# EAGLE board UFBmod_2V1 (EAGLE 7.7.0), part 1 of 2
UFBmod - the best digital modulation ever created :-)
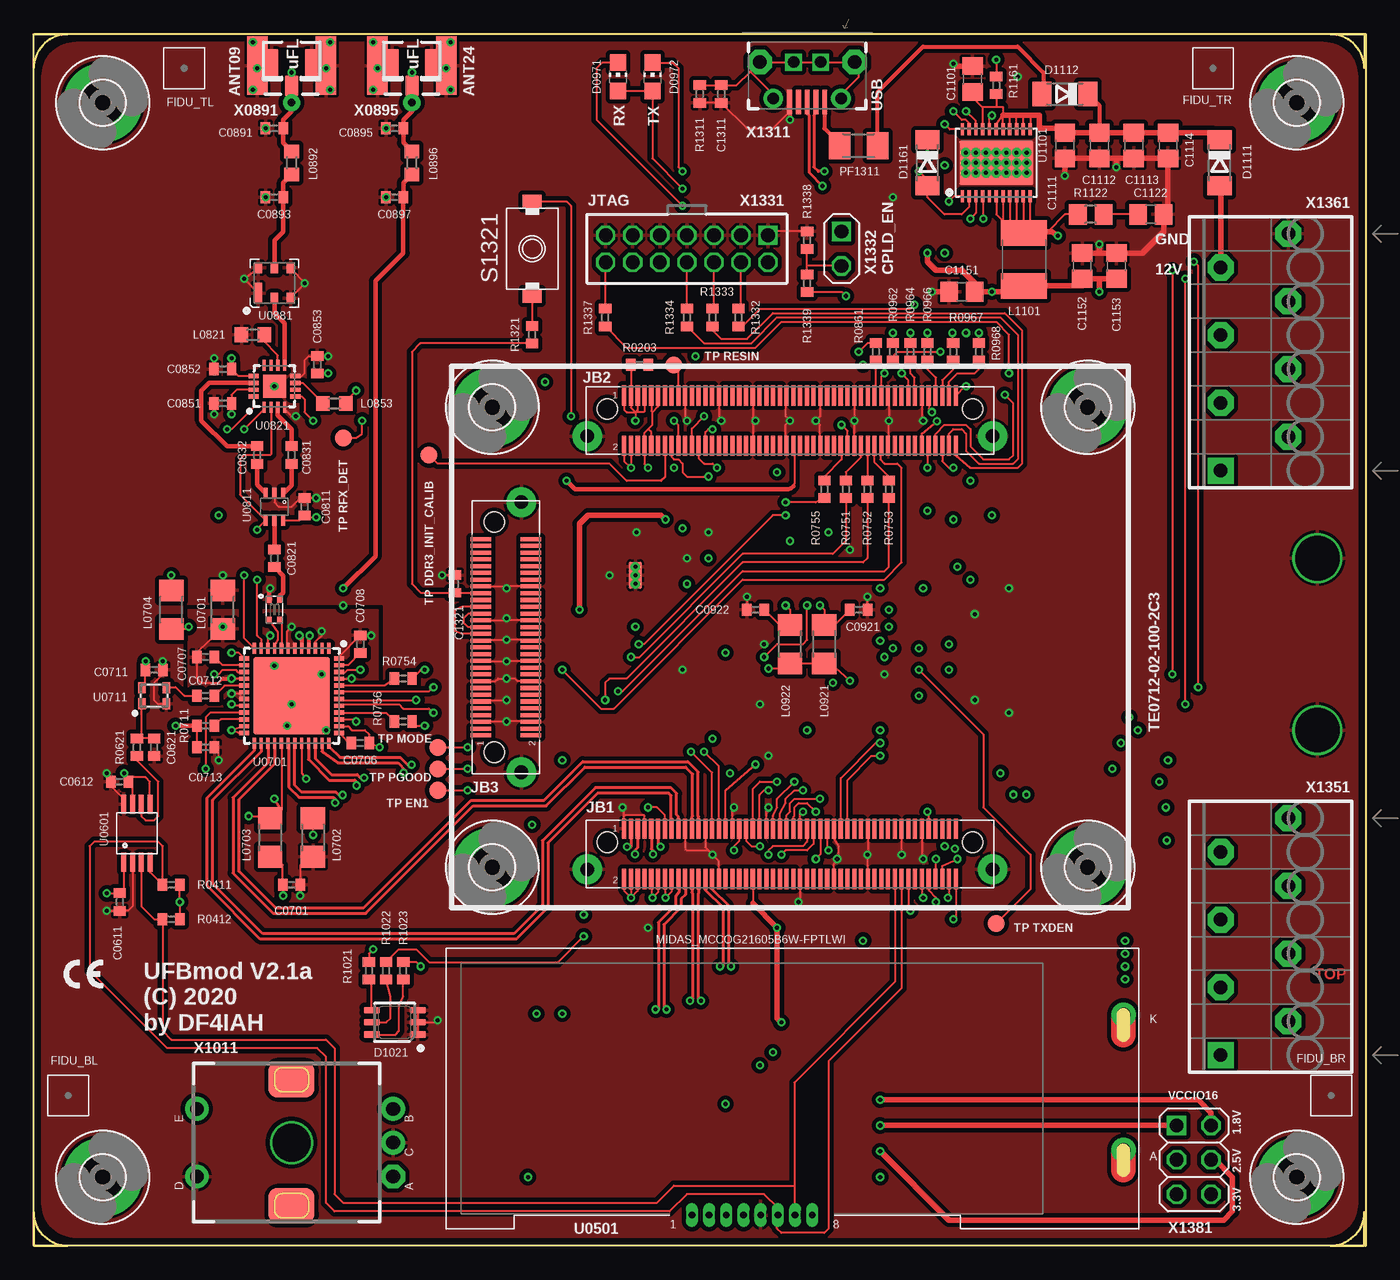
[diagram p15: board, top side]
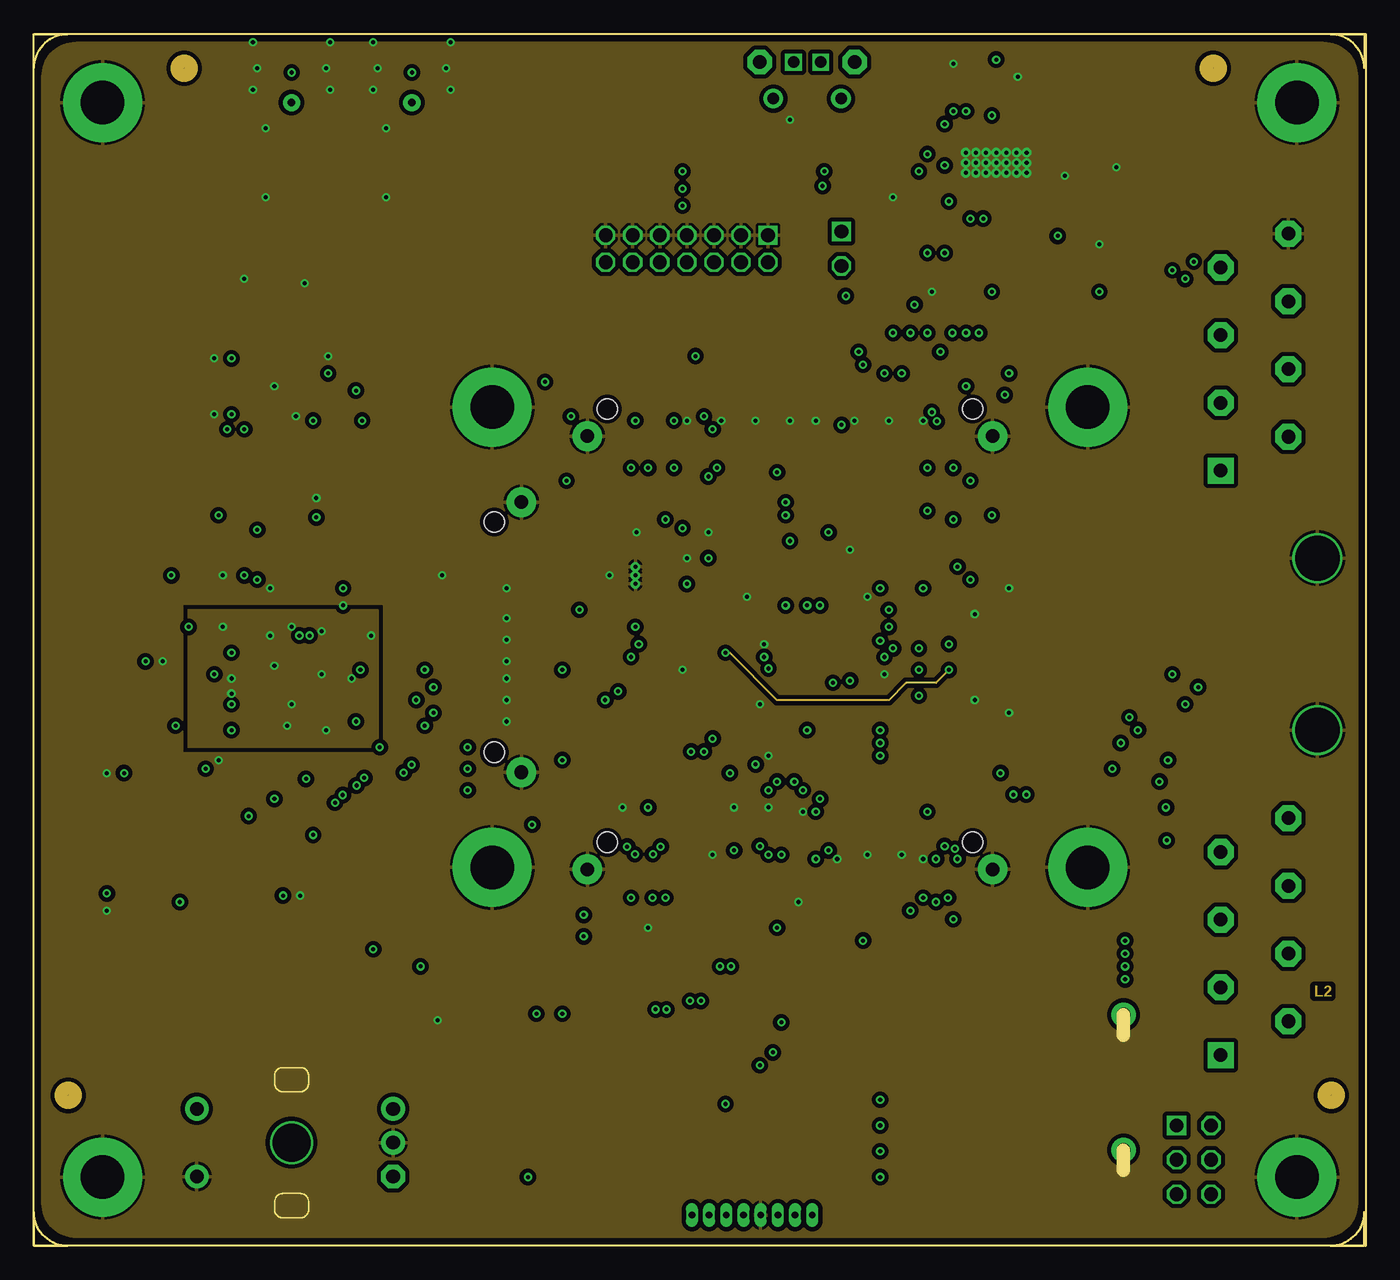
[diagram p16: board, inner layer Route2__GND_Pair_AVSS]
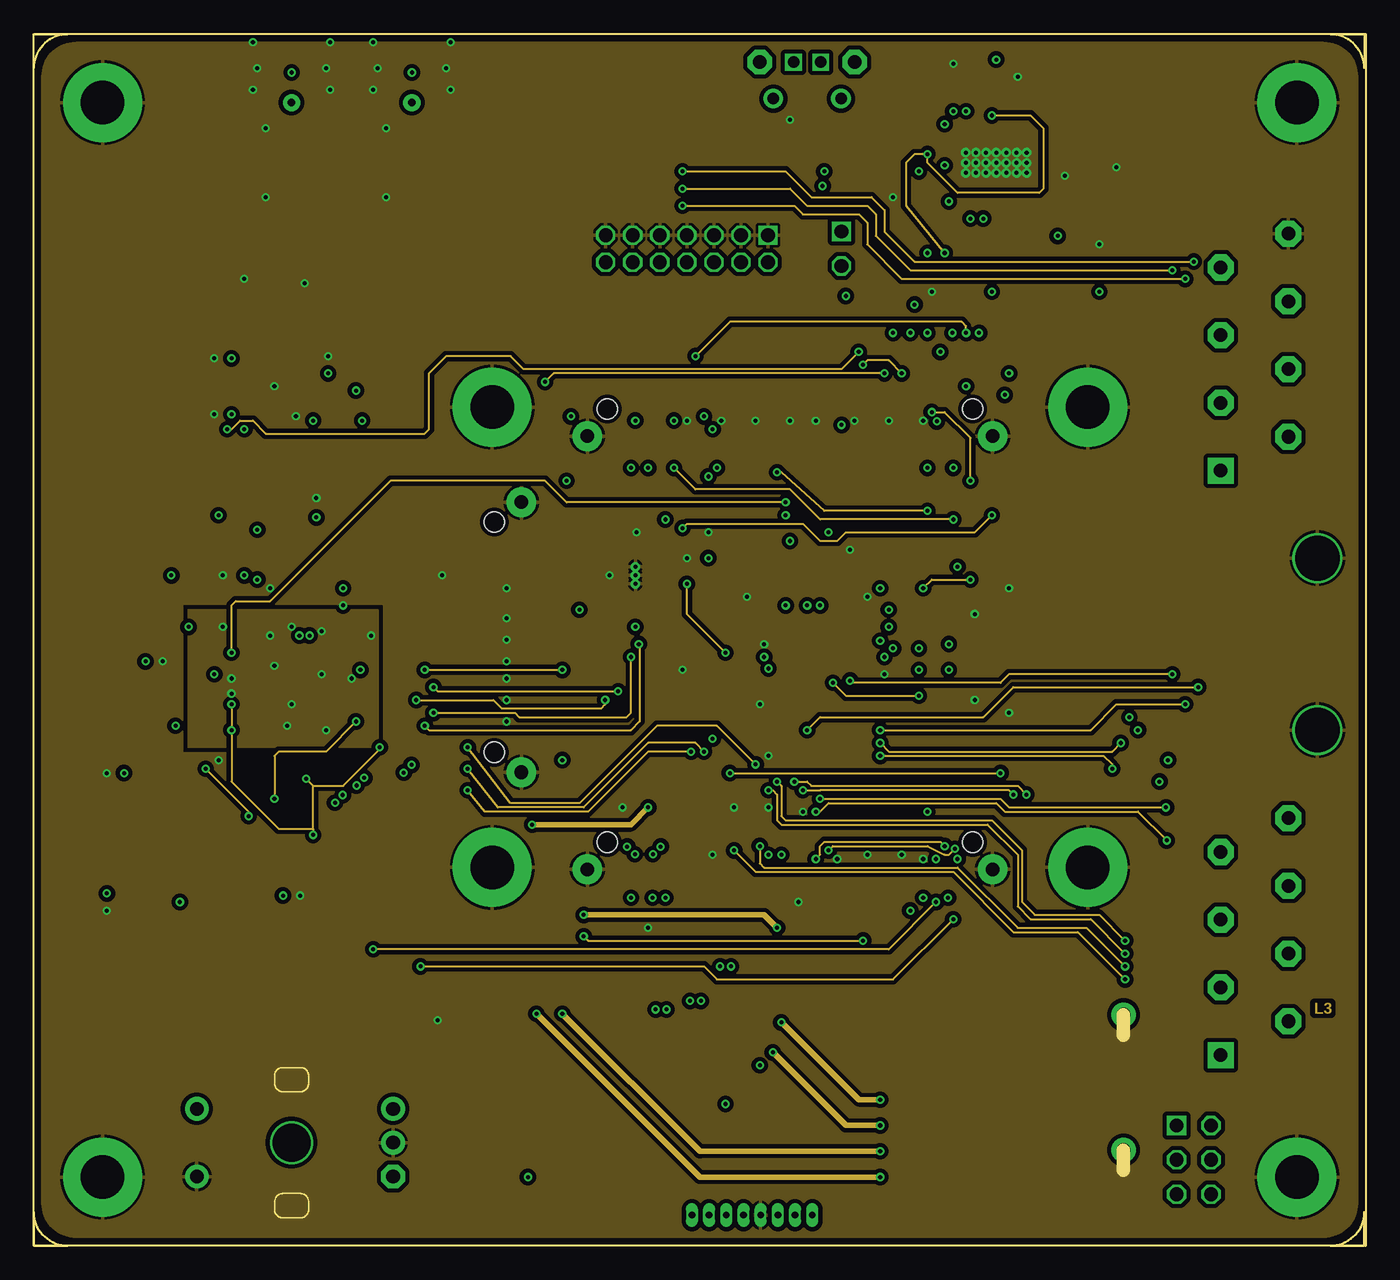
[diagram p17: board, inner layer Route3__SigC_GND]
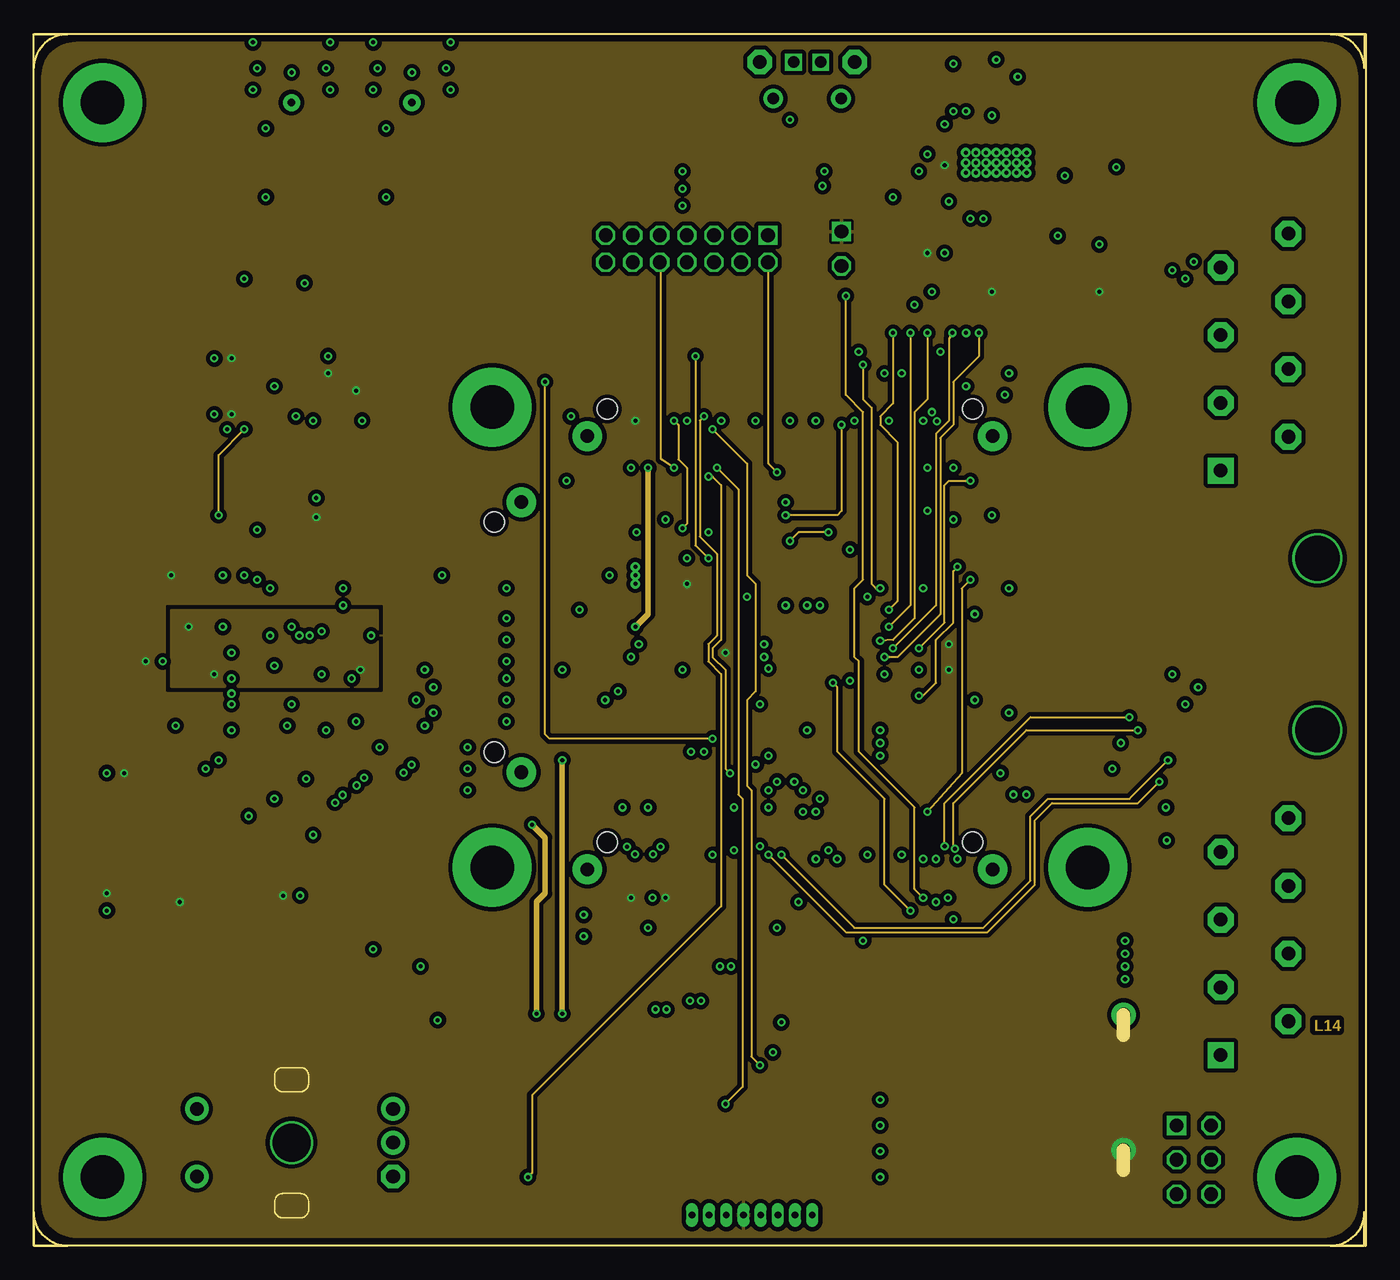
[diagram p18: board, inner layer Route14__VDD_SigD]
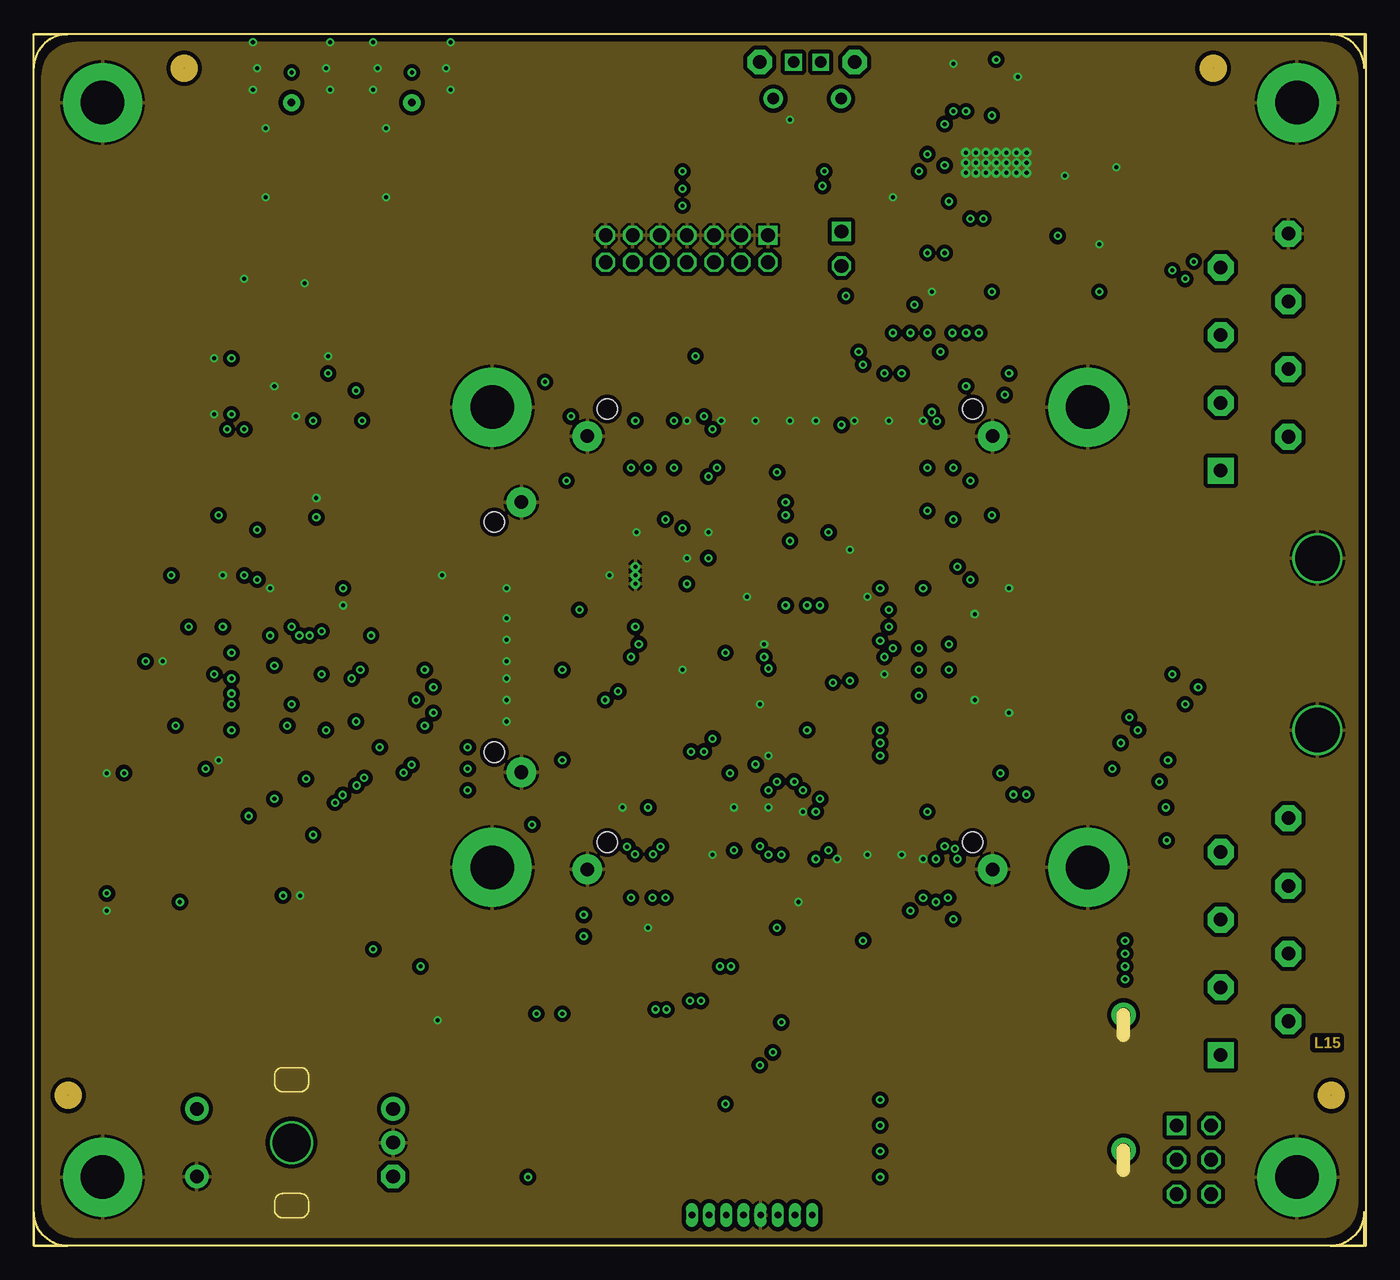
[diagram p19: board, inner layer Route15__GND_Pair]
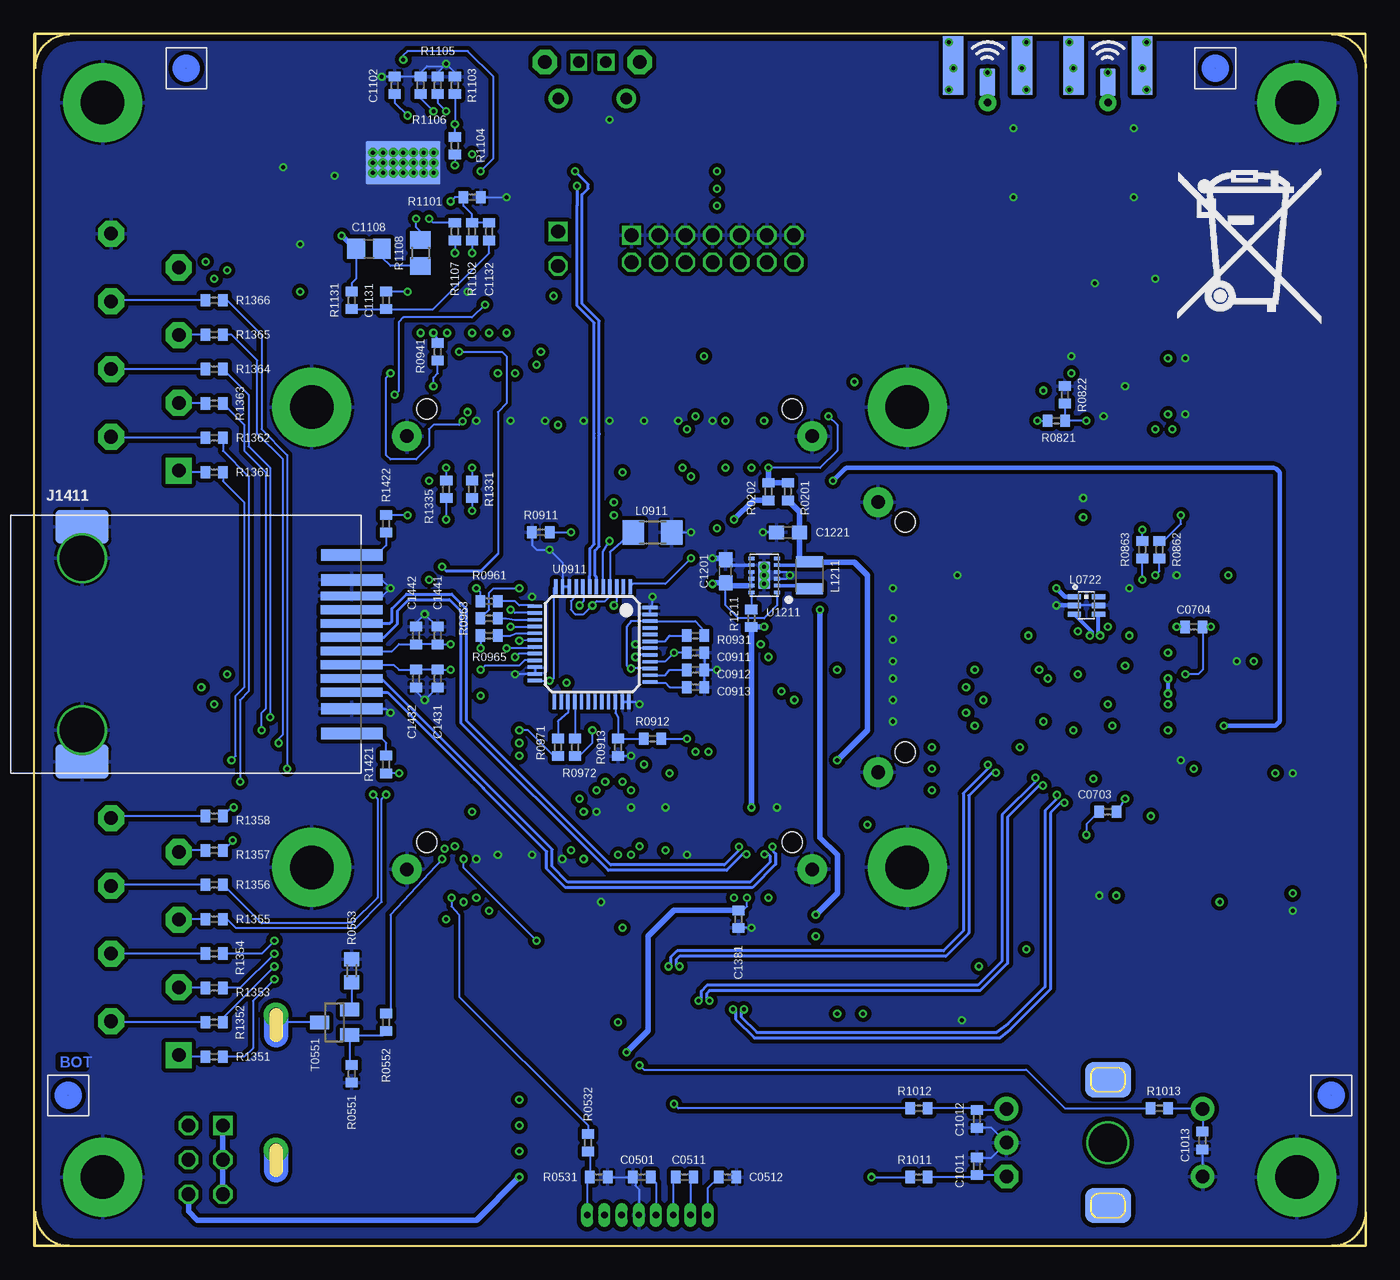
[diagram p20: board, bottom side, seen from below]

Size 98.42 x 89.53 mm. Coordinates in mm from the lower left corner, seen from the top.
Outline: 0,0 0,89.53 98.42,89.53 98.42,0 0,0
Copper layers (1+2+3*14+15+16): Top__SigA_Pair 0.035mm / dielectric 0.2mm / Route2__GND_Pair_AVSS 0.035mm / dielectric 0.36mm / Route3__SigC_GND 0.035mm / dielectric 0.28mm / Route14__VDD_SigD 0.035mm / dielectric 0.36mm / Route15__GND_Pair 0.035mm / dielectric 0.2mm / Bottom__SigB_Pair 0.035mm
Design rules "PCB-POOL Standard_ML6": minimum track width 0.15mm, minimum drill 0.3mm, track to track 0.15mm, track to pad 0.15mm, pad to pad 0.15mm, via to via 0.15mm, smd to smd 0.15mm, copper to edge 0.3mm, drill to drill 0.2mm, minimum pad ring 0.2mm, minimum via ring 0.15mm, stop-mask expansion 0.075mm, vias tented up to drill 0mil, thermal gap 0.2mm
Net classes: 0 default: width 0.127 mm, drill 0.3 mm, clearance 0.127 mm; 1 diff_100R_200u: width 0.203 mm, drill 0.3 mm, clearance 0.203 mm; 2 diff_100R_280u: width 0.229 mm, drill 0.3 mm, clearance 0.152 mm; 3 diff_100R_360u: width 0.267 mm, drill 0.3 mm, clearance 0.152 mm; 4 diff_90R_200u: width 0.216 mm, drill 0.3 mm, clearance 0.152 mm; 5 diff_90R_280u: width 0.292 mm, drill 0.3 mm, clearance 0.152 mm; 6 diff_90R_360u: width 0.318 mm, drill 0.3 mm, clearance 0.127 mm; 7 uni_50R_200u: width 0.343 mm, drill 0.3 mm, clearance 0.381 mm; 8 uni_50R_280u: width 0.483 mm, drill 0.3 mm, clearance 0.381 mm; 9 uni_50R_360u: width 0.635 mm, drill 0.3 mm, clearance 0.381 mm; 10 diff_50R_200u: width 0.508 mm, drill 0.3 mm, clearance 0.127 mm
tRestrict: area 15.9,37.8 to 16.2,43.5; area 15.9,43.5 to 22.2,43.8; area 21.9,37.5 to 22.2,43.5; area 15.9,37.5 to 21.9,37.8
Milling: area 0,87 to 2.5,89.5; area 0,0 to 2.5,2.5; area 95.8,0 to 98.3,2.5; area 95.8,87 to 98.3,89.5

## Footprints (pad centres in the part's own frame; a part is rotated, then mirrored left to right if it is on the bottom)
C0402 = smd 0.7 x 0.9: 1 -0.65,0; 2 0.65,0
C0805 = smd 1.3 x 1.5: 1 -0.95,0; 2 0.95,0
C0603 = smd 1.1 x 1: 1 -0.85,0; 2 0.85,0
CHIP-LED0805 = smd 1.2 x 1.2: A 0,-1.05; C 0,1.05
ASMT-YTB7_0AA02_RGB = smd 1.2 x 0.5: 1 -1.7,0.9; 2 -1.7,0; 3 -1.7,-0.9; 4 1.7,-0.9; 5 1.7,0; 6 1.7,0.9
SOD80C = smd 1.4 x 1.8: A 1.7,0; C -1.7,0
B1,27 = smd 1.27 x 1.27: TP 0,0
3,2-PAD = drill 3.2 pad 5.842: B3,2 0,0
ARJE-0034_RJ45_WITH_MAGNETICS = smd 0.813 x 4.597: 1 6.604,11.43; 2 4.775,11.43; 11 -4.75,11.43; 12 -6.579,11.43 | smd 0.61 x 4.597: 3 3.556,11.43; 4 2.54,11.43; 5 1.524,11.43; 6 0.508,11.43; 7 -0.508,11.43; 8 -1.524,11.43; 9 -2.54,11.43; 10 -3.556,11.43 | smd 2.489 x 3.912: GND@11 -8.674,-8.496; GND@21 8.674,-8.496 | drill 3.3 pad 3.7: GND@12 -6.35,-8.496; GND@22 6.35,-8.496
SAMTEC_LSHM-150-DV = smd 0.3 x 1.5: 1 12.25,-1.85; 2 12.25,1.85; 3 11.75,-1.85; 4 11.75,1.85; 5 11.25,-1.85; 6 11.25,1.85; 7 10.75,-1.85; 8 10.75,1.85; 9 10.25,-1.85; 10 10.25,1.85; 11 9.75,-1.85; 12 9.75,1.85; 13 9.25,-1.85; 14 9.25,1.85; 15 8.75,-1.85; 16 8.75,1.85; 17 8.25,-1.85; 18 8.25,1.85; 19 7.75,-1.85; 20 7.75,1.85; 21 7.25,-1.85; 22 7.25,1.85; 23 6.75,-1.85; 24 6.75,1.85; 25 6.25,-1.85; 26 6.25,1.85; 27 5.75,-1.85; 28 5.75,1.85; 29 5.25,-1.85; 30 5.25,1.85; 31 4.75,-1.85; 32 4.75,1.85; 33 4.25,-1.85; 34 4.25,1.85; 35 3.75,-1.85; 36 3.75,1.85; 37 3.25,-1.85; 38 3.25,1.85; 39 2.75,-1.85; 40 2.75,1.85; 41 2.25,-1.85; 42 2.25,1.85; 43 1.75,-1.85; 44 1.75,1.85; 45 1.25,-1.85; 46 1.25,1.85; 47 0.75,-1.85; 48 0.75,1.85; 49 0.25,-1.85; 50 0.25,1.85; 51 -0.25,-1.85; 52 -0.25,1.85; 53 -0.75,-1.85; 54 -0.75,1.85; 55 -1.25,-1.85; 56 -1.25,1.85; 57 -1.75,-1.85; 58 -1.75,1.85; 59 -2.25,-1.85; 60 -2.25,1.85; 61 -2.75,-1.85; 62 -2.75,1.85; 63 -3.25,-1.85; 64 -3.25,1.85; 65 -3.75,-1.85; 66 -3.75,1.85; 67 -4.25,-1.85; 68 -4.25,1.85; 69 -4.75,-1.85; 70 -4.75,1.85; 71 -5.25,-1.85; 72 -5.25,1.85; 73 -5.75,-1.85; 74 -5.75,1.85; 75 -6.25,-1.85; 76 -6.25,1.85; 77 -6.75,-1.85; 78 -6.75,1.85; 79 -7.25,-1.85; 80 -7.25,1.85; 81 -7.75,-1.85; 82 -7.75,1.85; 83 -8.25,-1.85; 84 -8.25,1.85; 85 -8.75,-1.85; 86 -8.75,1.85; 87 -9.25,-1.85; 88 -9.25,1.85; 89 -9.75,-1.85; 90 -9.75,1.85; 91 -10.25,-1.85; 92 -10.25,1.85; 93 -10.75,-1.85; 94 -10.75,1.85; 95 -11.25,-1.85; 96 -11.25,1.85; 97 -11.75,-1.85; 98 -11.75,1.85; 99 -12.25,-1.85; 100 -12.25,1.85 | drill 1 pad 2.2: F1 14.975,1.15; F2 -14.975,1.15 | hole 1.5: 13.5,-0.85; -13.5,-0.85
SAMTEC_LSHM-130-DV = smd 0.3 x 1.5: 1 7.25,-1.85; 2 7.25,1.85; 3 6.75,-1.85; 4 6.75,1.85; 5 6.25,-1.85; 6 6.25,1.85; 7 5.75,-1.85; 8 5.75,1.85; 9 5.25,-1.85; 10 5.25,1.85; 11 4.75,-1.85; 12 4.75,1.85; 13 4.25,-1.85; 14 4.25,1.85; 15 3.75,-1.85; 16 3.75,1.85; 17 3.25,-1.85; 18 3.25,1.85; 19 2.75,-1.85; 20 2.75,1.85; 21 2.25,-1.85; 22 2.25,1.85; 23 1.75,-1.85; 24 1.75,1.85; 25 1.25,-1.85; 26 1.25,1.85; 27 0.75,-1.85; 28 0.75,1.85; 29 0.25,-1.85; 30 0.25,1.85; 31 -0.25,-1.85; 32 -0.25,1.85; 33 -0.75,-1.85; 34 -0.75,1.85; 35 -1.25,-1.85; 36 -1.25,1.85; 37 -1.75,-1.85; 38 -1.75,1.85; 39 -2.25,-1.85; 40 -2.25,1.85; 41 -2.75,-1.85; 42 -2.75,1.85; 43 -3.25,-1.85; 44 -3.25,1.85; 45 -3.75,-1.85; 46 -3.75,1.85; 47 -4.25,-1.85; 48 -4.25,1.85; 49 -4.75,-1.85; 50 -4.75,1.85; 51 -5.25,-1.85; 52 -5.25,1.85; 53 -5.75,-1.85; 54 -5.75,1.85; 55 -6.25,-1.85; 56 -6.25,1.85; 57 -6.75,-1.85; 58 -6.75,1.85; 59 -7.25,-1.85; 60 -7.25,1.85 | drill 1 pad 2.2: F1 9.975,1.15; F2 -9.975,1.15 | hole 1.5: 8.5,-0.85; -8.5,-0.85
R1206 = smd 1.6 x 1.803: 1 -1.422,0; 2 1.422,0
DXW21HN5011BL = smd 0.5 x 0.45: 1 -0.775,-0.4; 2 0.775,-0.4; 3 0.775,0.4; 4 -0.775,0.4
2450BL15B050 = smd 0.35 x 1: 1 -0.65,-0.9; 2 0,-0.9; 3 0.65,-0.9; 4 0.65,0.9; 5 0,0.9; 6 -0.65,0.9
L0603 = smd 1 x 1.1: 1 -0.85,0; 2 0.85,0
L1812 = smd 1.9 x 3.4: 1 -1.95,0; 2 1.95,0
L2520 = smd 0.8 x 2: 1 -1,0; 2 1,0
M1206 = smd 1.6 x 2: 1 -1.4,0; 2 1.4,0
R0402 = smd 0.7 x 0.9: 1 -0.65,0; 2 0.65,0
R0603 = smd 1 x 1.1: 1 -0.85,0; 2 0.85,0
R0805 = smd 1.3 x 1.5: 1 -0.95,0; 2 0.95,0
KSR223G_SMD_1POL = smd 1 x 1.4: 1 -3.5,0; 2 3.5,0
SOT23 = smd 1 x 1.4: 1 -0.95,-1.1; 2 0.95,-1.1; 3 0,1.1
MIDAS_MCCOG21605B6W-FPTLWI = drill 0.5 pad 0.7 long: 1 18.155,1; 2 19.425,1; 3 20.695,1; 4 21.965,1; 5 23.235,1; 6 24.505,1; 7 25.775,1; 8 27.045,1 | drill 1 pad 1.8: 11 50.05,15.8; 12 50.05,5.8
µMAX8 = smd 1.35 x 0.4: 1 -2.15,0.975; 2 -2.15,0.325; 3 -2.15,-0.325; 4 -2.15,-0.975; 5 2.15,-0.975; 6 2.15,-0.325; 7 2.15,0.325; 8 2.15,0.975
QFN48_7X7-0P5-PAD = smd 0.8 x 0.3: 1 -3.5,2.75; 2 -3.5,2.25; 3 -3.5,1.75; 4 -3.5,1.25; 5 -3.5,0.75; 6 -3.5,0.25; 7 -3.5,-0.25; 8 -3.5,-0.75; 9 -3.5,-1.25; 10 -3.5,-1.75; 11 -3.5,-2.25; 12 -3.5,-2.75; 25 3.5,-2.75; 26 3.5,-2.25; 27 3.5,-1.75; 28 3.5,-1.25; 29 3.5,-0.75; 30 3.5,-0.25; 31 3.5,0.25; 32 3.5,0.75; 33 3.5,1.25; 34 3.5,1.75; 35 3.5,2.25; 36 3.5,2.75 | smd 0.3 x 0.8: 13 -2.75,-3.5; 14 -2.25,-3.5; 15 -1.75,-3.5; 16 -1.25,-3.5; 17 -0.75,-3.5; 18 -0.25,-3.5; 19 0.25,-3.5; 20 0.75,-3.5; 21 1.25,-3.5; 22 1.75,-3.5; 23 2.25,-3.5; 24 2.75,-3.5; 37 2.75,3.5; 38 2.25,3.5; 39 1.75,3.5; 40 1.25,3.5; 41 0.75,3.5; 42 0.25,3.5; 43 -0.25,3.5; 44 -0.75,3.5; 45 -1.25,3.5; 46 -1.75,3.5; 47 -2.25,3.5; 48 -2.75,3.5 | smd 5.65 x 5.65: 49 0,0
ASVTX-13 = smd 0.6 x 0.8: 1 -0.9,-0.6; 2 0.9,-0.6; 3 0.9,0.6; 4 -0.9,0.6
SC-70_6-LEAD_2X1MM25_0P65 = smd 0.4 x 0.8: 1 -0.65,-1; 2 0,-1; 3 0.65,-1; 4 0.65,1; 5 0,1; 6 -0.65,1
QFN16-3X3-0P5-PAD = smd 0.8 x 0.3: 1 -1.55,0.75; 2 -1.55,0.25; 3 -1.55,-0.25; 4 -1.55,-0.75; 9 1.55,-0.75; 10 1.55,-0.25; 11 1.55,0.25; 12 1.55,0.75 | smd 0.3 x 0.8: 5 -0.75,-1.55; 6 -0.25,-1.55; 7 0.25,-1.55; 8 0.75,-1.55; 13 0.75,1.55; 14 0.25,1.55; 15 -0.25,1.55; 16 -0.75,1.55 | smd 1.7 x 1.7: 17 0,0
B3440_3MM-X-3MM = smd 0.65 x 1.55: 1 -1.2,-0.75 | smd 0.65 x 0.8: 2 0,-1.125; 3 1.2,-1.125; 4 1.2,1.125; 5 0,1.125; 6 -1.2,1.125
LQFP48 = smd 1.1 x 0.25: 1 -4.25,2.8; 2 -4.25,2.3; 3 -4.25,1.8; 4 -4.25,1.3; 5 -4.25,0.8; 6 -4.25,0.3; 7 -4.25,-0.2; 8 -4.25,-0.7; 9 -4.25,-1.2; 10 -4.25,-1.7; 11 -4.25,-2.2; 12 -4.25,-2.7; 25 4.25,-2.8; 26 4.25,-2.3; 27 4.25,-1.8; 28 4.25,-1.3; 29 4.25,-0.8; 30 4.25,-0.3; 31 4.25,0.2; 32 4.25,0.7; 33 4.25,1.2; 34 4.25,1.7; 35 4.25,2.2; 36 4.25,2.7 | smd 0.25 x 1.1: 13 -2.8,-4.25; 14 -2.3,-4.25; 15 -1.8,-4.25; 16 -1.3,-4.25; 17 -0.8,-4.25; 18 -0.3,-4.25; 19 0.2,-4.25; 20 0.7,-4.25; 21 1.2,-4.25; 22 1.7,-4.25; 23 2.2,-4.25; 24 2.7,-4.25; 37 2.8,4.25; 38 2.3,4.25; 39 1.8,4.25; 40 1.3,4.25; 41 0.8,4.25; 42 0.3,4.25; 43 -0.2,4.25; 44 -0.7,4.25; 45 -1.2,4.25; 46 -1.7,4.25; 47 -2.2,4.25; 48 -2.7,4.25
DQP-22 = smd 0.28 x 0.85: 1 -2.5,-2.475; 2 -2,-2.475; 3 -1.5,-2.475; 4 -1,-2.475; 5 -0.5,-2.475; 6 0,-2.475; 7 0.5,-2.475; 8 1,-2.475; 9 1.5,-2.475; 10 2,-2.475; 11 2.5,-2.475; 12 2.5,2.475; 13 2,2.475; 14 1.5,2.475; 15 1,2.475; 16 0.5,2.475; 17 0,2.475; 18 -0.5,2.475; 19 -1,2.475; 20 -1.5,2.475; 21 -2,2.475; 22 -2.5,2.475 | smd 5.48 x 3.24: 23 0,0 | smd 5.48 x 3.24 bottom: 24 0,0 | drill 0.3 pad 0.61: P$1 -2.25,-0.75; P$2 -1.5,-0.75; P$3 -0.75,-0.75; P$4 0,-0.75; P$5 0.75,-0.75; P$6 1.5,-0.75; P$7 2.25,-0.75; P$8 -2.25,0; P$9 -1.5,0; P$10 -0.75,0; P$11 0,0; P$12 0.75,0; P$13 1.5,0; P$14 2.25,0; P$15 -2.25,0.75; P$16 -1.5,0.75; P$17 -0.75,0.75; P$18 0,0.75; P$19 0.75,0.75; P$20 1.5,0.75; P$21 2.25,0.75
WSON-12 = smd 0.5 x 0.25: 1 -0.95,1.25; 2 -0.95,0.75; 3 -0.95,0.25; 4 -0.95,-0.25; 5 -0.95,-0.75; 6 -0.95,-1.25; 7 0.95,-1.25; 8 0.95,-0.75; 9 0.95,-0.25; 10 0.95,0.25; 11 0.95,0.75; 12 0.95,1.25 | smd 0.9 x 2: 13 0,0 | smd 0.9 x 2 bottom: 14 0,0 | drill 0.3 pad 0.6: G1 0,0; G2 0,0.635; G3 0,-0.635
SMA_UFL_PAD_TINY = smd 1.524 x 1.016: ANT1 -3.843,0 | drill 0.559 pad 1.27: ANT2 -5.08,0 | smd 2.032 x 1.143 bottom: ANT3 -3.589,0 | smd 2.2 x 1.016: GND1 -2.223,1.47; GND2 -2.223,-1.47 | smd 4.318 x 1.524: GND3 -2.349,-2.54; GND4 -2.349,2.54 | smd 4.318 x 1.524 bottom: GND5 -2.349,2.54; GND6 -2.349,-2.54
TTE_EN11-HSM = drill 1 pad 1.75 octagon: A -2.5,-7.5 | drill 1 pad 1.75: B 2.5,-7.5; C 0,-7.5; D -2.5,7; E 2.5,7 | smd 2.6 x 3.4: GND11 -4.65,0; GND12 4.65,0 | smd 2.6 x 3.4 bottom: GND21 -4.65,0; GND22 4.65,0 | drill 2.8 pad 2.8: P$1 0,0
USB-B-MICRO-SMD_MOLEX-105017-0001 = smd 0.35 x 1.8: D+ 0,4.4; D- -0.65,4.4; GND 1.3,4.4; ID 0.65,4.4; VBUS -1.3,4.4 | drill 0.85 pad 1.45: JSHIELD -2.5,4.15; JSHIELD@2 2.5,4.15 | drill 1 pad 1.8 octagon: JSHIELD@3 -3.5,1.45; JSHIELD@6 3.5,1.45 | drill 0.85 square: JSHIELD@4 -1,1.45; JSHIELD@5 1,1.45
2X07_2MM00_SHROUDED_XILINX_JTAG = drill 1.016 square: 1 -6,-1 | drill 1.016 octagon: 2 -6,1; 3 -4,-1; 4 -4,1; 5 -2,-1; 6 -2,1; 7 0,-1; 8 0,1; 9 2,-1; 10 2,1; 11 4,-1; 12 4,1; 13 6,-1; 14 6,1
1X02 = drill 1.016 square: 1 0,0 | drill 1.016 octagon: 2 0,2.54
PHOENIX_1990067_1X8X2MM50_PTSA-0-5 = drill 1 pad 1.93 square: 1 -7.5,5 | drill 1 pad 1.93 octagon: 2 -5,0; 3 -2.5,5; 4 0,0; 5 2.5,5; 6 5,0; 7 7.5,5; 8 10,0
2X03 = drill 1.016 square: 1 -2.54,-1.27 | drill 1.016 octagon: 2 -2.54,1.27; 3 0,-1.27; 4 0,1.27; 5 2.54,-1.27; 6 2.54,1.27

## Placement (x,y rotation side)
C0501  100nF  [C0402]  53.5,5.08 180 bottom
C0511  1uF  [C0402]  50.32,5.08 0 bottom
C0512  1uF  [C0402]  47.15,5.08 0 bottom
C0611  100nF  [C0402]  6.35,25.4 270 top
C0612  100nF  [C0402]  6.35,34.29 180 top
C0621  1uF  [C0402]  8.89,36.83 270 top
C0701  1uF  [C0402]  19.05,26.67 0 top
C0703  1uF  [C0402]  19.05,32.07 180 bottom
C0704  1uF  [C0402]  12.7,45.72 180 bottom
C0706  100nF  [C0402]  24.13,37.15 180 top
C0707  100nF  [C0402]  12.7,43.5 0 top
C0708  100nF  [C0402]  24.13,44.45 270 top
C0711  10nF  [C0402]  8.89,42.55 0 top
C0712  10nF  [C0402]  12.7,40.64 0 top
C0713  N/A  [C0402]  12.7,36.83 180 top
C0811  100nF  [C0402]  20,54.61 90 top
C0821  1nF  [C0402]  17.78,50.8 270 top
C0831  1nF  [C0402]  19.05,58.42 270 top
C0832  1nF  [C0402]  16.51,58.42 270 top
C0851  10nF  [C0402]  13.97,62.23 180 top
C0852  10nF  [C0402]  13.97,64.77 180 top
C0853  10nF  [C0402]  20.95,65.09 90 top
C0891  0pF  [C0402]  17.78,82.55 180 top
C0893  0pF  [C0402]  17.78,77.47 180 top
C0895  0pF  [C0402]  26.67,82.55 180 top
C0897  0pF  [C0402]  26.67,77.47 180 top
C0911  100nF  [C0402]  49.53,43.81 0 bottom
C0912  100nF  [C0402]  49.53,42.55 180 bottom
C0913  100nF  [C0402]  49.53,41.27 180 bottom
C0921  100nF  [C0402]  60.96,46.99 180 top
C0922  100nF  [C0402]  53.34,46.99 0 top
C1011  100nF  [C0402]  28.73,5.87 90 bottom
C1012  100nF  [C0402]  28.73,9.37 270 bottom
C1013  100nF  [C0402]  12.06,7.78 270 bottom
C1101  4.7uF  [C0805]  69.37,86.2 270 top
C1102  1uF  [C0402]  71.75,85.72 270 bottom
C1108  100nF  [C0805]  73.66,73.66 0 bottom
C1111  22uF  [C0805]  76.2,81.28 90 top
C1112  22uF  [C0805]  78.74,81.28 90 top
C1113  22uF  [C0805]  81.28,81.28 90 top
C1114  22uF  [C0805]  83.82,81.28 90 top
C1122  N/A  [C0805]  82.55,76.2 0 top
C1131  100nF  [C0402]  72.39,69.85 270 bottom
C1132  1nF  [C0402]  64.77,74.93 90 bottom
C1151  100uF  [C0805]  68.58,70.48 180 top
C1152  100uF  [C0805]  77.47,72.39 90 top
C1153  100uF  [C0805]  80.01,72.39 90 top
C1201  10uF  [C0603]  47.31,49.85 90 bottom
C1221  10uF  [C0603]  42.7,52.7 180 bottom
C1311  1nF  [C0402]  50.8,85.09 90 top
C1321  100nF  [C0402]  31.11,48.9 270 top
C1381  100nF  [C0402]  46.35,24.13 90 bottom
C1431  1uF  [C0402]  68.58,41.91 270 bottom
C1432  100nF  [C0402]  70.17,41.91 270 bottom
C1441  1uF  [C0402]  68.58,45.09 90 bottom
C1442  100nF  [C0402]  70.17,45.09 90 bottom
D0971  CMD17-21VGD/TR8 GREEN  [CHIP-LED0805]  43.18,86.36 0 top
D0972  CMD17-21VRD/TR8 RED  [CHIP-LED0805]  45.72,86.36 0 top
D1021  ASMT-YTB7-0AA02_RGB  [ASMT-YTB7_0AA02_RGB]  26.67,16.51 180 top
D1111  CRS08  [SOD80C]  87.63,80.01 270 top
D1112  CRS08  [SOD80C]  76.2,85.09 180 top
D1161  CRS08  [SOD80C]  66.04,80.01 270 top
FIDU_BL  [FIDUCIAL_MARK_1MM]  2.54,11.11 0 top
FIDU_BR  [FIDUCIAL_MARK_1MM]  95.89,11.11 0 top
FIDU_TL  [FIDUCIAL_MARK_1MM]  11.11,87 0 top
FIDU_TR  [FIDUCIAL_MARK_1MM]  87.15,87 0 top
FPGA_EN1  TPB1,27  [B1,27]  29.84,33.66 0 top
FPGA_MODE  TPB1,27  [B1,27]  29.84,36.83 0 top
H1511  MOUNT-PAD-ROUND3.2  [3,2-PAD]  5.08,84.45 0 top
H1512  MOUNT-PAD-ROUND3.2  [3,2-PAD]  5.08,5.08 0 top
H1513  MOUNT-PAD-ROUND3.2  [3,2-PAD]  93.34,84.45 0 top
H1514  MOUNT-PAD-ROUND3.2  [3,2-PAD]  93.34,5.08 0 top
HB_351  MOUNT-PAD-ROUND3.2  [3,2-PAD]  77.88,27.96 180 top
HB_352  MOUNT-PAD-ROUND3.2  [3,2-PAD]  77.88,61.96 180 top
HB_353  MOUNT-PAD-ROUND3.2  [3,2-PAD]  33.88,27.96 180 top
HB_354  MOUNT-PAD-ROUND3.2  [3,2-PAD]  33.88,61.96 180 top
J1411  ABRACON_ARJE-0034  [ARJE-0034_RJ45_WITH_MAGNETICS]  86.36,44.45 270 bottom
JB1  LSHM-150-04.0-L-DV-A-S-K-TR  [SAMTEC_LSHM-150-DV]  55.88,28.96 180 top
JB2  LSHM-150-04.0-L-DV-A-S-K-TR  [SAMTEC_LSHM-150-DV]  55.88,60.96 180 top
JB3  LSHM-130-04.0-L-DV-A-S-K-TR  [SAMTEC_LSHM-130-DV]  34.88,44.96 270 top
L0701  0R  [R1206]  13.97,46.99 270 top
L0702  0R  [R1206]  20.64,30.16 90 top
L0703  300R  [R1206]  17.46,30.16 90 top
L0704  300R  [R1206]  10.16,46.99 270 top
L0721  MURATA DXW21HN5011BL  [DXW21HN5011BL]  17.78,46.99 270 top
L0722  Johanson 2450BL15B050E  [2450BL15B050]  20.64,47.31 270 bottom
L0821  2.7nH  [L0603]  16.19,67.31 180 top
L0853  6.8nH  [L0603]  22.23,62.23 180 top
L0892  0nH  [L0603]  19.05,80.01 90 top
L0896  0nH  [L0603]  27.94,80.01 90 top
L0911  300R  [R1206]  52.7,52.7 180 bottom
L0921  300R  [R1206]  58.42,44.45 270 top
L0922  300R  [R1206]  55.88,44.45 270 top
L1101  440nH  [L1812]  73.18,72.87 90 top
L1211  4.7uH  [L2520]  41.12,49.53 270 bottom
PF1311  1.1A/2.2A  [M1206]  60.96,81.28 180 top
PGOOD  TPB1,27  [B1,27]  29.84,35.24 0 top
R0201  0R  [R0402]  42.7,55.72 90 bottom
R0202  N/A  [R0402]  44.13,55.72 90 bottom
R0203  10kR  [R0402]  44.77,65.09 180 top
R0411  3.9kR  [R0402]  10.16,26.67 0 top
R0412  3.9kR  [R0402]  10.16,24.13 0 top
R0531  220kR  [R0402]  56.67,5.08 180 bottom
R0532  1kR  [R0402]  57.47,7.62 270 bottom
R0551  1.5kR  [R0402]  74.93,12.7 90 bottom
R0552  2.0kR  [R0402]  72.39,16.51 90 bottom
R0553  27R  [R0603]  74.93,20.32 270 bottom
R0621  100kR  [R0402]  7.62,36.83 90 top
R0711  130R  [R0402]  12.7,38.42 0 top
R0751  100R  [R0402]  60.01,55.88 90 top
R0752  100R  [R0402]  61.59,55.88 90 top
R0753  100R  [R0402]  63.18,55.88 90 top
R0754  100R  [R0402]  27.3,41.91 0 top
R0755  100R  [R0402]  58.42,55.88 90 top
R0756  100R  [R0402]  27.3,38.73 0 top
R0821  100R  [R0402]  22.86,60.96 180 bottom
R0822  10kR  [R0402]  22.23,62.87 270 bottom
R0861  10kR  [R0402]  62.23,66.04 90 top
R0862  10kR  [R0402]  15.24,51.44 90 bottom
R0863  10kR  [R0402]  16.51,51.44 90 bottom
R0911  12kR 1%0  [R0402]  60.96,52.7 0 bottom
R0912  100R  [R0402]  52.7,37.47 180 bottom
R0913  100kR  [R0402]  55.24,36.83 90 bottom
R0931  10kR  [R0402]  49.53,45.09 0 bottom
R0941  100R  [R0402]  68.58,66.04 90 bottom
R0961  100R  [R0402]  64.77,47.62 180 bottom
R0962  100R  [R0402]  63.5,66.04 270 top
R0963  100R  [R0402]  64.77,46.35 180 bottom
R0964  100R  [R0402]  64.77,66.04 270 top
R0965  100R  [R0402]  64.77,45.09 180 bottom
R0966  100R  [R0402]  66.04,66.04 270 top
R0967  100R  [R0402]  67.94,66.04 270 top
R0968  100R  [R0402]  69.85,66.04 270 top
R0971  560R  [R0402]  59.69,36.83 270 bottom
R0972  560R  [R0402]  58.42,36.83 270 bottom
R1011  1kR  [R0402]  33.02,5.08 180 bottom
R1012  1kR  [R0402]  33.02,10.16 180 bottom
R1013  1kR  [R0402]  15.24,10.16 180 bottom
R1021  820R  [R0402]  24.77,20.32 90 top
R1022  1kR  [R0402]  26.04,20.32 90 top
R1023  820R  [R0402]  27.3,20.32 90 top
R1101  10kR 0%5  [R0402]  66.04,77.47 180 bottom
R1102  45.3kR 0%5  [R0402]  66.04,74.93 270 bottom
R1103  N/A  [R0402]  67.31,85.72 270 bottom
R1104  N/A  [R0402]  67.31,81.28 90 bottom
R1105  110kR  [R0402]  68.58,85.72 270 bottom
R1106  200kR  [R0402]  69.85,85.72 270 bottom
R1107  100kR  [R0402]  67.31,74.93 270 bottom
R1108  2R  [R0805]  69.85,73.34 270 bottom
R1122  N/A  [R0805]  78.11,76.2 180 top
R1131  15kR  [R0402]  74.93,69.85 270 bottom
R1161  220kR  [R0402]  71.12,85.72 270 top
R1211  10kR  [R0402]  45.4,46.35 90 bottom
R1311  330kR  [R0402]  49.21,85.09 90 top
R1321  1kR  [R0402]  36.83,67.31 90 top
R1331  1kR  [R0402]  66.04,55.88 90 bottom
R1332  100R  [R0402]  52.07,68.58 270 top
R1333  100R  [R0402]  50.16,68.58 270 top
R1334  100R  [R0402]  48.26,68.58 270 top
R1335  100R  [R0402]  67.94,55.88 90 bottom
R1337  100R  [R0402]  42.23,68.58 270 top
R1338  10kR  [R0402]  57.15,74.3 90 top
R1339  100R  [R0402]  57.15,71.12 270 top
R1351  100R  [R0402]  85.09,13.97 180 bottom
R1352  100R  [R0402]  85.09,16.51 180 bottom
R1353  100R  [R0402]  85.09,19.05 180 bottom
R1354  100R  [R0402]  85.09,21.59 180 bottom
R1355  100R  [R0402]  85.09,24.13 180 bottom
R1356  100R  [R0402]  85.09,26.67 180 bottom
R1357  100R  [R0402]  85.09,29.21 180 bottom
R1358  100R  [R0402]  85.09,31.75 180 bottom
R1361  100R  [R0402]  85.09,57.15 180 bottom
R1362  100R  [R0402]  85.09,59.69 180 bottom
R1363  100R  [R0402]  85.09,62.23 180 bottom
R1364  100R  [R0402]  85.09,64.77 180 bottom
R1365  100R  [R0402]  85.09,67.31 180 bottom
R1366  100R  [R0402]  85.09,69.85 180 bottom
R1421  470R  [R0402]  72.39,35.56 90 bottom
R1422  470R  [R0402]  72.39,53.34 270 bottom
S1321  KSR223G_SMD_1POL  [KSR223G_SMD_1POL]  36.83,73.66 90 top
T0551  MMBT2222  [SOT23]  76.2,16.51 90 bottom
TP1371  TPB1,27  [B1,27]  29.21,58.42 0 top
TP_RESIN  TPB1,27  [B1,27]  47.31,65.09 0 top
TP_RFX_DET  TPB1,27  [B1,27]  22.86,59.69 0 top
TP_TXDEN  TPB1,27  [B1,27]  71.12,23.81 0 top
U0501  MIDAS_MCCOG21605B6W-FPTLWI  [MIDAS_MCCOG21605B6W-FPTLWI]  30.48,1.27 0 top
U0601  MAX5217  [µMAX8]  7.62,30.48 90 top
U0701  AT86RF215-ZU  [QFN48_7X7-0P5-PAD]  19.05,40.64 270 top
U0711  ASVTX-13-D-26.000MHZ-I05-T  [ASVTX-13]  8.89,40.64 0 top
U0811  PE4259  [SC-70_6-LEAD_2X1MM25_0P65]  17.78,54.61 180 top
U0821  RFX1010  [QFN16-3X3-0P5-PAD]  17.78,63.5 90 top
U0881  B39871B3440U410  [B3440_3MM-X-3MM]  17.78,71.12 0 top
U0911  FT232HL  [LQFP48]  57.15,44.45 270 bottom
U1101  TPS53353  [DQP-22]  71.12,80.01 0 top
U1211  TPS62745DSSR  [WSON-12]  44.45,49.53 180 bottom
X0891  ANTENNATINY  [SMA_UFL_PAD_TINY]  19.05,89.53 90 top
X0895  ANTENNATINY  [SMA_UFL_PAD_TINY]  27.94,89.53 90 top
X1011  TTE_EN11-HSM  [TTE_EN11-HSM]  19.05,7.62 90 top
X1311  MOLEX 105017-0001  [USB-B-MICRO-SMD_MOLEX-105017-0001]  57.15,88.9 180 top
X1331  [2X07_2MM00_SHROUDED_XILINX_JTAG]  48.26,73.66 180 top
X1332  [1X02]  59.69,74.93 180 top
X1351  PHOENIX_1990067_1X8X2MM50_PTSA-0-5  [PHOENIX_1990067_1X8X2MM50_PTSA-0-5]  92.71,21.59 90 top
X1361  PHOENIX_1990067_1X8X2MM50_PTSA-0-5  [PHOENIX_1990067_1X8X2MM50_PTSA-0-5]  92.71,64.77 90 top
X1381  [2X03]  85.72,6.35 270 top